# Altium schematic sheet TI TPS56837.SchDoc
size A; SheetNumber: 1; SheetTotal: 1
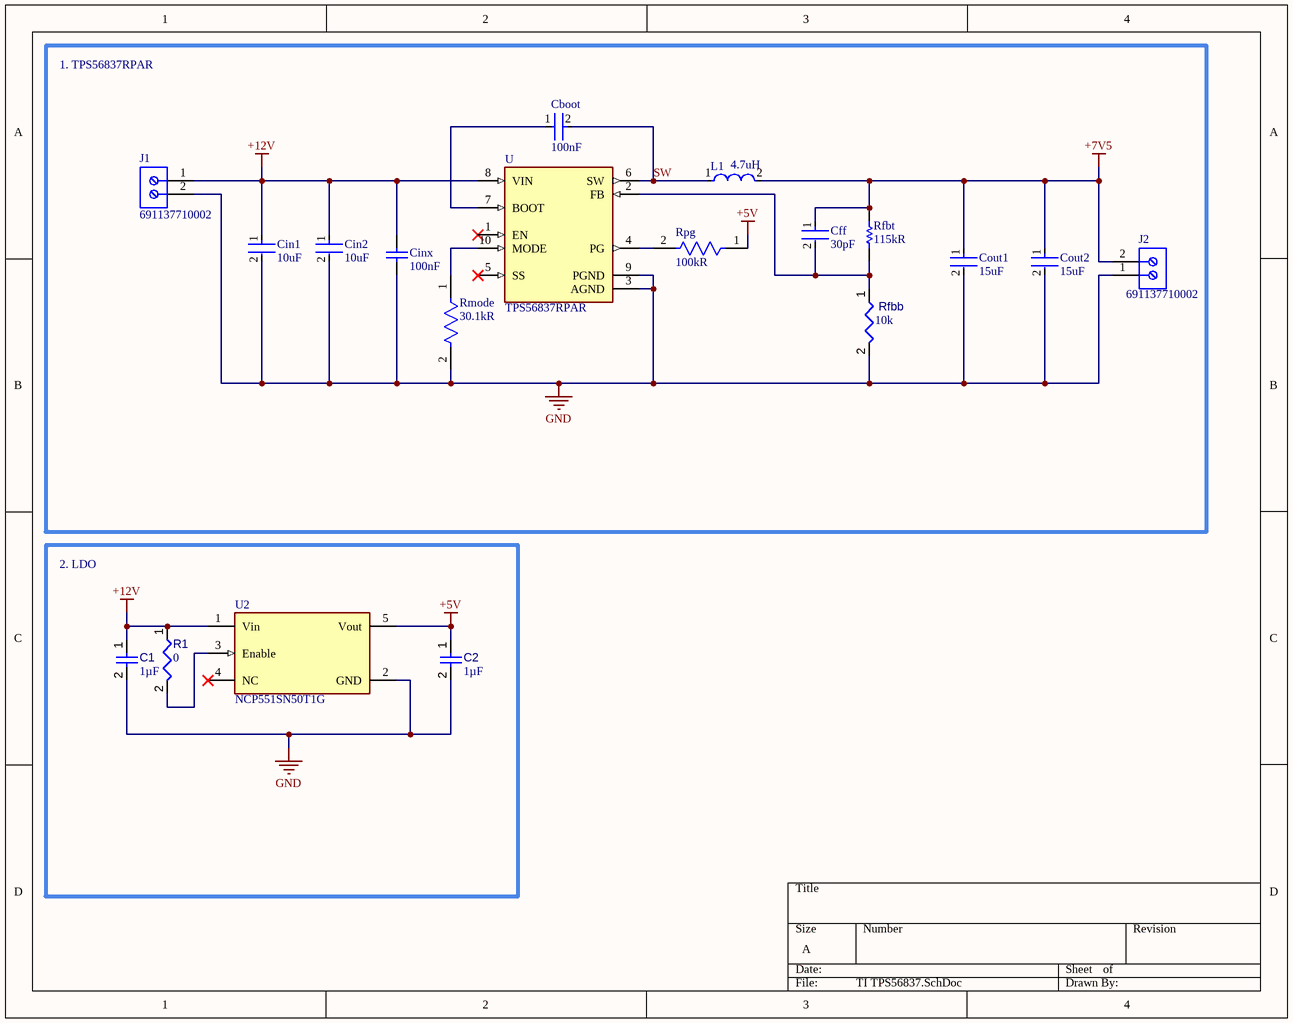
[diagram p0: TI TPS56837.SchDoc]

## Parts
C1  value 1µF  [CAPC0402(1005)60_L]  (hidden comment: Capacitor 1µF +/-20% 10V 0402)
C2  value 1µF  [CAPC0402(1005)60_L]  (hidden comment: Capacitor 1µF +/-20% 10V 0402)
Cboot  value 100nF  [FP-GRM15-MFG]  (hidden comment: GRM155R71C104KA88D)
Cff  value 30pF  [FP-CL10-IPC_B]  (hidden comment: CL10C300FB8NNNC)
Cin1  value 10uF  [FP-GRM21B-0_15-IPC_A]  (hidden comment: GRM21BR61E106MA73L)
Cin2  value 10uF  [FP-GRM21B-0_15-IPC_A]  (hidden comment: GRM21BR61E106MA73L)
Cinx  value 100nF  [CAPC2013X135X45LL10T25]  (hidden comment: GRM21BR71H104KA01L)
Cout1  value 15uF  [FP-C3225-250-0_4-IPC_A]  (hidden comment: C3225X5R1C156M250AA)
Cout2  value 15uF  [FP-C3225-250-0_4-IPC_A]  (hidden comment: C3225X5R1C156M250AA)
J1  691137710002  [691137710002]
J2  691137710002  [691137710002]
L1  value 4.7uH  [FP-IHLP-5050EZ-FP_3_226x4-MFG]  (hidden comment: IHLP5050EZER4R7M01)
R1  value 0  [RESC0402(1005)_L]  (hidden comment: 0R2J)
Rfbb  value 10k  [RESC0402(1005)_L]  (hidden comment: Resistor 10K  +/-1 % 0402 63 mW)
Rfbt  value 115kR  [RESC2013X70X40NL20T20]  (hidden comment: ERJ-6ENF1153V)
Rmode  value 30.1kR  [FP-CRCW0402-e3-IPC_A]  (hidden comment: CRCW040230K1FKED)
Rpg  value 100kR  [FP-CRCW0402-e3-IPC_A]  (hidden comment: CRCW0402100KFKED)
U  TPS56837RPAR  [CONV_TPS56637RPAR]
U2  NCP551SN50T1G  [FP-483-IPC_C]

## Blocks framed on the sheet
1. TPS56837RPAR: Cboot Cff Cin1 Cin2 Cinx Cout1 Cout2 J1 J2 L1 Rfbb Rfbt Rmode Rpg U
2. LDO: C1 C2 R1 U2

## Nets
+5V: C2.1 Rpg.1 U2.5(Vout)
+7V5: Cff.1 Cout1.1 Cout2.1 J2.2 L1.2 Rfbt.1
+12V: C1.1 Cin1.1 Cin2.1 Cinx.1 J1.1 R1.1 U.8(VIN) U2.1(Vin)
GND: C1.2 C2.2 Cin1.2 Cin2.2 Cinx.2 Cout1.2 Cout2.2 J1.2 J2.1 Rfbb.2 Rmode.2 U.3(AGND) U.9(PGND) U2.2(GND)
SW: Cboot.2 L1.1 U.6(SW)
NetCboot_1: Cboot.1 U.7(BOOT)
NetCff_2: Cff.2 Rfbb.1 Rfbt.2 U.2(FB)
NetR1_2: R1.2 U2.3(Enable)
NetRmode_1: Rmode.1 U.10(MODE)
NetRpg_2: Rpg.2 U.4(PG)

Not connected (* = marked no-connect by the designer): U 1(EN)* 5(SS)*; U2 4(NC)*

## Library data of the parts
C1 C2 = CMP-001-00063-3: Chip Capacitor, 1µF +/-20%, 10V, 0402, Thickness 0.6 mm; Tolerance: 10%; Mounting Technology: SMT; Max Operating Temperature: 85°C; Voltage Rating: 10V; Pins: 2; Case/Package: 0402; Min Operating Temperature: -55°C
Cboot = CMP-001-00088-1: Multilayer Ceramic Capacitor, 0.1 uF, 16 V, ± 10%, X7R, 0402 [1005 Metric]; Voltage: 16V; Packaging: Tape and Reel; Depth: 0.5mm; RoHS Compliant: Yes; Length: 1mm; Width: 0.02inch; Reach SVHC Compliant: Unknown; Lead Free: Lead Free; Case Code (Metric): 1005; Dielectric: X7R; Min Operating Temperature: -55°C; Pins: 2; Mounting Technology: Surface Mount; Dielectric Material: Ceramic; Radiation Hardening: No; Material: Ceramic; Voltage Rating (DC): 16V; Max Operating Temperature: 125°C; Tolerance: 10%; Voltage Rating: 16V; Height: 0.5mm; Package Quantity: 1; Case/Package: 0402; Termination: SMD/SMT; Case Code (Imperial): 0402; Series: GRM; Thickness: 0.022inch
Cff = CMP-001-00089-1: Cap Ceramic 30pF 50V C0G 1% SMD 0603 125°C Paper T/R; Depth: 0.8mm; Radiation Hardening: No; Min Operating Temperature: -55°C; Case Code (Metric): 1608; RoHS Compliant: Yes; Series: CL; Voltage Rating (DC): 50V; Tolerance: 1%; Case/Package: 0603; Case Code (Imperial): 0603; Mounting Technology: Surface Mount; Length: 0.063inch; Width: 0.031inch; Package Quantity: 1; Packaging: Tape and Reel; Voltage Rating: 50V; Dielectric: C0G; Max Operating Temperature: 125°C; Thickness: 0.035inch
Cin1 Cin2 = CMP-001-00085-1: Multilayer Ceramic Capacitor, 10 uF, 25 V, ± 20%, X5R, 0805 [2012 Metric]; Voltage Rating (DC): 25V; Tolerance: 20%; Min Operating Temperature: -55°C; RoHS Compliant: Yes; Height: 1.25mm; Case Code (Metric): 2012; Series: GRM; Termination: SMD/SMT; Voltage Rating: 25V; Weight: 0.000335oz; Thickness: 0.055inch; Package Quantity: 3000; Reach SVHC Compliant: No; Mounting Technology: Surface Mount; Material: Ceramic; Case/Package: 0805; Dielectric: X5R; Width: 0.049inch; Max Operating Temperature: 85°C; Length: 0.079inch; Lead Free: Lead Free; Packaging: Tape and Reel; Case Code (Imperial): 0805
Cinx = CMP-001-00090-1: CAP CER 0.1UF 50V X7R 0805 / Cap Ceramic 0.1uF 50V X7R 10% Pad SMD 0805 125¡ãC T/R; Insulation Resistance: 10GR; Depth: 1.25mm; Voltage Rating: 50V; Width: 0.049inch; Mounting Technology: Surface Mount; Lead Free: Lead Free; Package Quantity: 1; Height: 1.25mm; Voltage Rating (DC): 50V; Thickness: 0.053inch; Tolerance: 10%; Case Code (Metric): 2012; Case/Package: 0805; Length: 2mm; Case Code (Imperial): 0805; Reach SVHC Compliant: No; Series: GRM; Packaging: Tape and Reel; Min Operating Temperature: -55°C; Dielectric: X7R; Dielectric Material: Ceramic; Termination: SMD/SMT; Voltage: 50V; Max Operating Temperature: 125°C; Pins: 2; RoHS Compliant: Yes; Material: Ceramic
Cout1 Cout2 = CMP-001-00086-1: Voltage Rating: 16V; Dielectric Material: Ceramic; Tolerance: 20%; Dielectric: X5R; Packaging: Tape and Reel; Weight: 0.000564oz; Case/Package: 1210; Termination: SMD/SMT; Case Code (Imperial): 1210; Series: C; Material: Ceramic; Case Code (Metric): 3225; RoHS Compliant: Yes; Mounting Technology: Surface Mount; Width: 0.098inch; Thickness: 0.11inch; Depth: 2.5mm; Height: 2mm; Package Quantity: 1000; Max Operating Temperature: 85°C; Length: 3.2mm; Construction: Flat; Lead Free: Lead Free; Voltage Rating (DC): 16V; Min Operating Temperature: -55°C
J1 J2 = CMP-002-00088-1: Series 1377 - 5.00 mm Horizontal Entry with Pressure Clamp WR-TBL, 2 pin; Number of Contacts: 2; Current: 16A; Wire Gauge (Max): 30AWG; Voltage: 300V; Plating: Copper Alloy,ZINC PLATED; Wire Gauge (Min): 12AWG; Number of Levels: 1; Housing Material: PC; RoHS Compliant: Yes; Termination: Screw; Contact Material: Nickel,Tin; Color: Green; Pins: 2; Number of Rows: 1; Max Operating Temperature: 120°C; Current Rating: 16A; Number of Positions Per Level: 2; Mounting Technology: Through Hole; Min Operating Temperature: -30°C; Height: 11.6mm; Series: WR-TBL Series 1377; Lead Pitch: 5mm; Voltage Rating: 300V
L1 = CMP-006-00021-1: Inductor Power Shielded Wirewound 4.7uH 20% 100KHz Powdered Iron 12A 15mOhm DCR 5050 T/R; Max DC Current: 27A; Self Resonant Frequency: 5MHz; Core Material: Ferrite; DC Resistance (DCR): 15mR; Mounting Technology: Surface Mount; Military Standard: Not; Radiation Hardening: No; Length: 13.2mm; Max Current Rating: 12A; Min Operating Temperature: -55°C; Current Rating: 12A; Max Operating Temperature: 125°C; Packaging: Tape and Reel; Series: IHLP-5050EZ-01; RoHS Compliant: Yes; Test Frequency: 100kHz; Case/Package: 5050; Depth: 12.9mm; Lead Free: Lead Free; Reach SVHC Compliant: Unknown; Termination: SMD/SMT; RMS Current (Irms): 12A; Shielding: Shielded; Saturation Current: 27A; Pins: 2; Tolerance: 20%; Package Quantity: 250; Inductance Tolerance: 20%; Height: 5mm; Width: 12.9mm
R1 = CMP-009-00062-2: Jumper 0402 (1005 Metric); Pins: 2; Mounting Technology: SMT; Case/Package: 0402
Rfbb = CMP-009-00149-3: Chip Resistor, 10 kOhms, +/-1 %, 63 mW, -55 to 125 degC, 0402; Power: 63mW; Tolerance: 1%; Min Operating Temperature: -55°C; Case/Package: 0402; Max Operating Temperature: 155°C; Pins: 2
Rfbt = CMP-009-00188-1: Res Thick Film 0805 115K Ohm 1% 0.125W ±100ppm/°C Molded SMD Punched Carrier T/R; Voltage Rating: 150V; Power Rating: 125mW; Mounting Technology: Surface Mount; Tolerance: 1%; Contact Plating: Tin; RoHS Compliant: Yes; Lead Free: Lead Free; Temperature Coefficient: 100ppm/°C; Case Code (Imperial): 0805; Voltage Rating (DC): 150V; Min Operating Temperature: -55°C; Weight: 0.000194oz; Case Code (Metric): 2012; Resistance Tolerance: 1%; Case/Package: 0805; Series: ERJ; Max Power Dissipation: 125mW; Max Operating Temperature: 155°C; Width: 1.2mm; Length: 0.079inch; Resistor Type: Thick Film; Reach SVHC Compliant: Yes; Package Quantity: 1; Features: Automotive AEC-Q200; Packaging: Tape and Reel; Termination: SMD/SMT; Number of Terminations: 2; Height: 0.028inch
Rmode = CMP-009-00189-1: SMD Chip Resistor, 30.1 kOhm, ± 1%, 63 mW, 0402 [1005 Metric], Thick Film, General Purpose; Max Power Dissipation: 63mW; Temperature Coefficient: 100ppm/°C; Voltage Rating: 50V; Contact Plating: Tin; Weight: 2.3E-05oz; Case/Package: 0402; Termination: SMD/SMT; Features: Automotive AEC-Q200; Case Code (Imperial): 0402; Tolerance: 1%; Min Operating Temperature: -55°C; RoHS Compliant: Yes; Radiation Hardening: No; Depth: 0.5mm; Package Quantity: 10; Series: CRCW; Length: 1mm; Height: 0.35mm; Technology: THICK FILM; Pins: 2; Voltage Rating (DC): 50V; Construction: Rectangular; Power Rating: 63mW; Resistor Type: Thick Film; Lead Free: Lead Free; Width: 0.02inch; Number of Terminations: 2; Max Operating Temperature: 155°C; Reach SVHC Compliant: Unknown; Military Standard: Not; Case Code (Metric): 1005; Resistance Tolerance: 1%; Packaging: Tape and Reel
Rpg = CMP-009-00190-1: SMD Chip Resistor, 100 kOhm, ± 1%, 63 mW, 0402 [1005 Metric], Thick Film, General Purpose; Power Rating: 63mW; Voltage Rating (DC): 50V; Temperature Coefficient: 100ppm/°C; Ratings: AEC-Q200; Radiation Hardening: No; Termination: SMD/SMT; Pins: 2; Case Code (Metric): 1005; Height: 0.35mm; Min Operating Temperature: -55°C; Military Standard: Not; Width: 0.5mm; Construction: Rectangular; Case/Package: 0402; Length: 1mm; Resistor Type: Thick Film; Max Power Dissipation: 63mW; Contact Plating: Tin; Number of Terminations: 2; RoHS Compliant: Yes; Case Code (Imperial): 0402; Voltage Rating: 50V; Series: CRCW; Lead Free: Lead Free; Max Operating Temperature: 155°C; Technology: THICK FILM; Depth: 0.5mm; Package Quantity: 10000; Features: Automotive AEC-Q200; Tolerance: 1%; Weight: 2.3E-05oz; Resistance Tolerance: 1%; Reach SVHC Compliant: Unknown; Packaging: Tape and Reel
U = CMP-034-000000-3: 4.5-V to 28-V input, 8-A synchronous buck converter 10-VQFN-HR -40 to 150; MF: Texas Instruments; Pin Count: 9; Source: SnapEDAsch.SchLib; MP: TPS56637RPAR; Value: *; SnapEDA_Link: https://www.snapeda.com/parts/TPS56637RPAR/Texas%20Instruments/view-part/3595662/?ref=snap; Component Type: Standard; Design Item ID: TPS56637RPAR; Availability: Unavailable; Price: None; Package: PowerVFQFN-10 Texas Instruments
U2 = CMP-019-00051-1: NCP551SN50T1G; LDO Voltage Regulator; 150mA; 5 V 2%; 0 to 12 Vin; 5-Pin TSOP; Min Input Voltage: 0V; Quiescent Current: 8uA; Number of Regulators: 1; Dropout Voltage: 40mV; Nominal Output Voltage: 5V; Polarity: Positive; Input Bias Current: 4uA; Max Supply Voltage: 12V; Max Output Voltage: 5.1V; Output Type: Fixed; Accuracy: 2%; Package Quantity: 1; Case/Package: TSOP; Termination: SMD/SMT; Number of Outputs: 1; Mounting Technology: Surface Mount; Series: -; Output Current: 150mA; Height: 1mm; Max Output current: 150mA; Pins: 5; Lead Free: Lead Free; Halogen Free: Halogen Free; Min Output Voltage: 5V; RoHS Compliant: Yes; Min Supply Voltage: 0V; Min Operating Temperature: -40°C; Reach SVHC Compliant: No; Packaging: Tape and Reel; Max Operating Temperature: 85°C; Length: 3mm; Output Voltage: 5V; Width: 1.5mm; Radiation Hardening: No